# EAGLE board Harms Professional RAM-16-3 (EAGLE 6.4), part 1 of 2
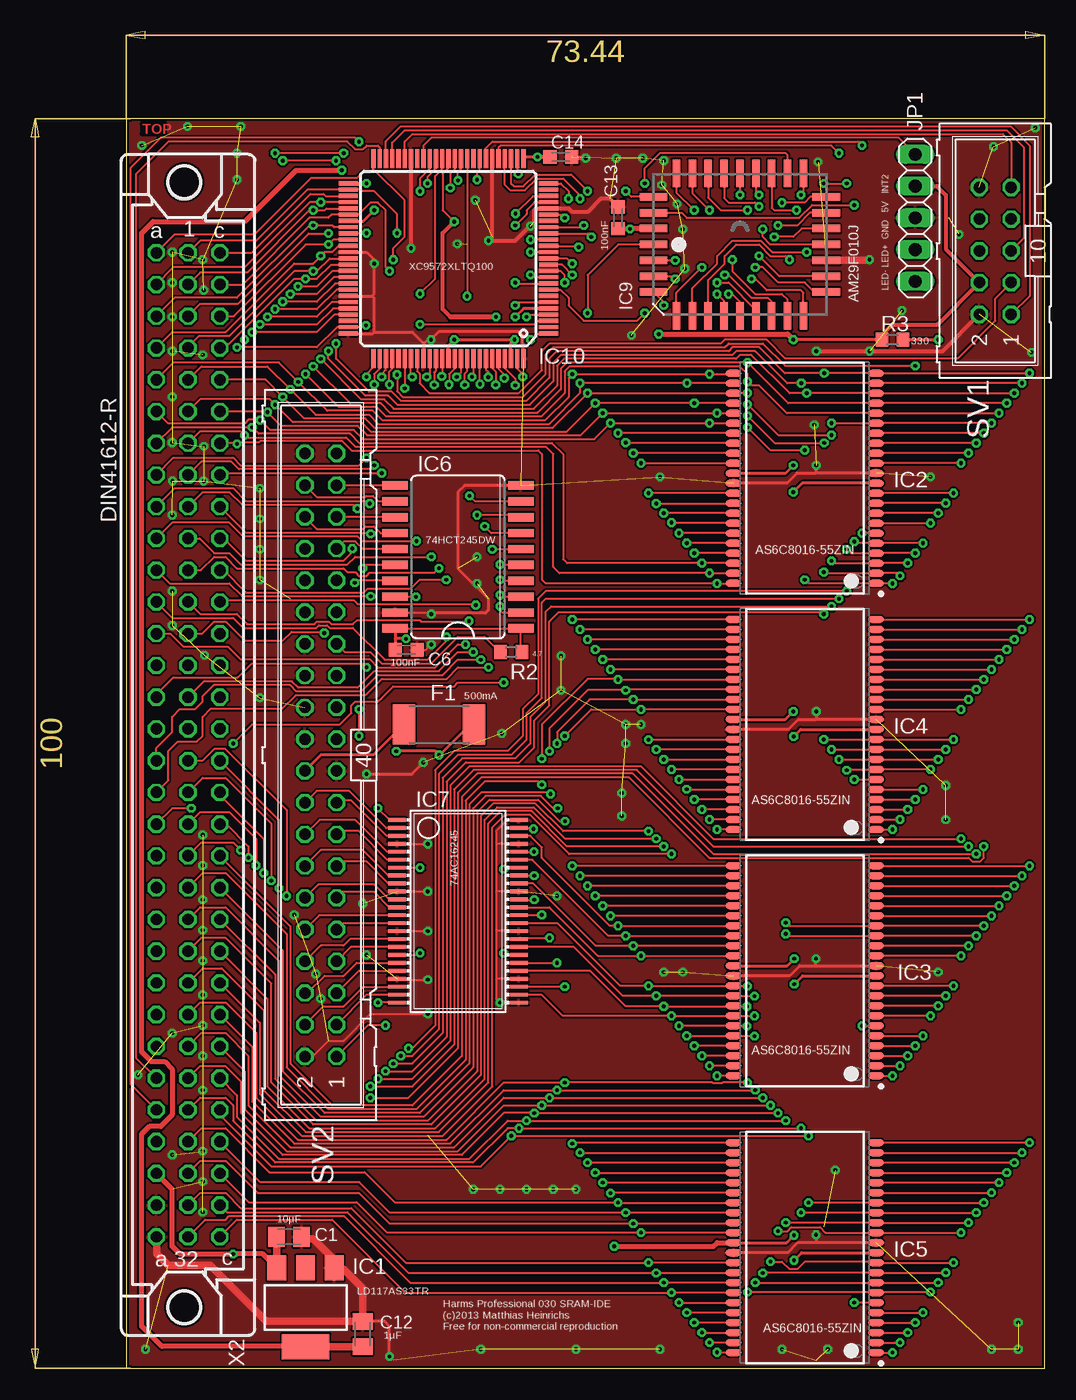
[diagram p2: board, top side]
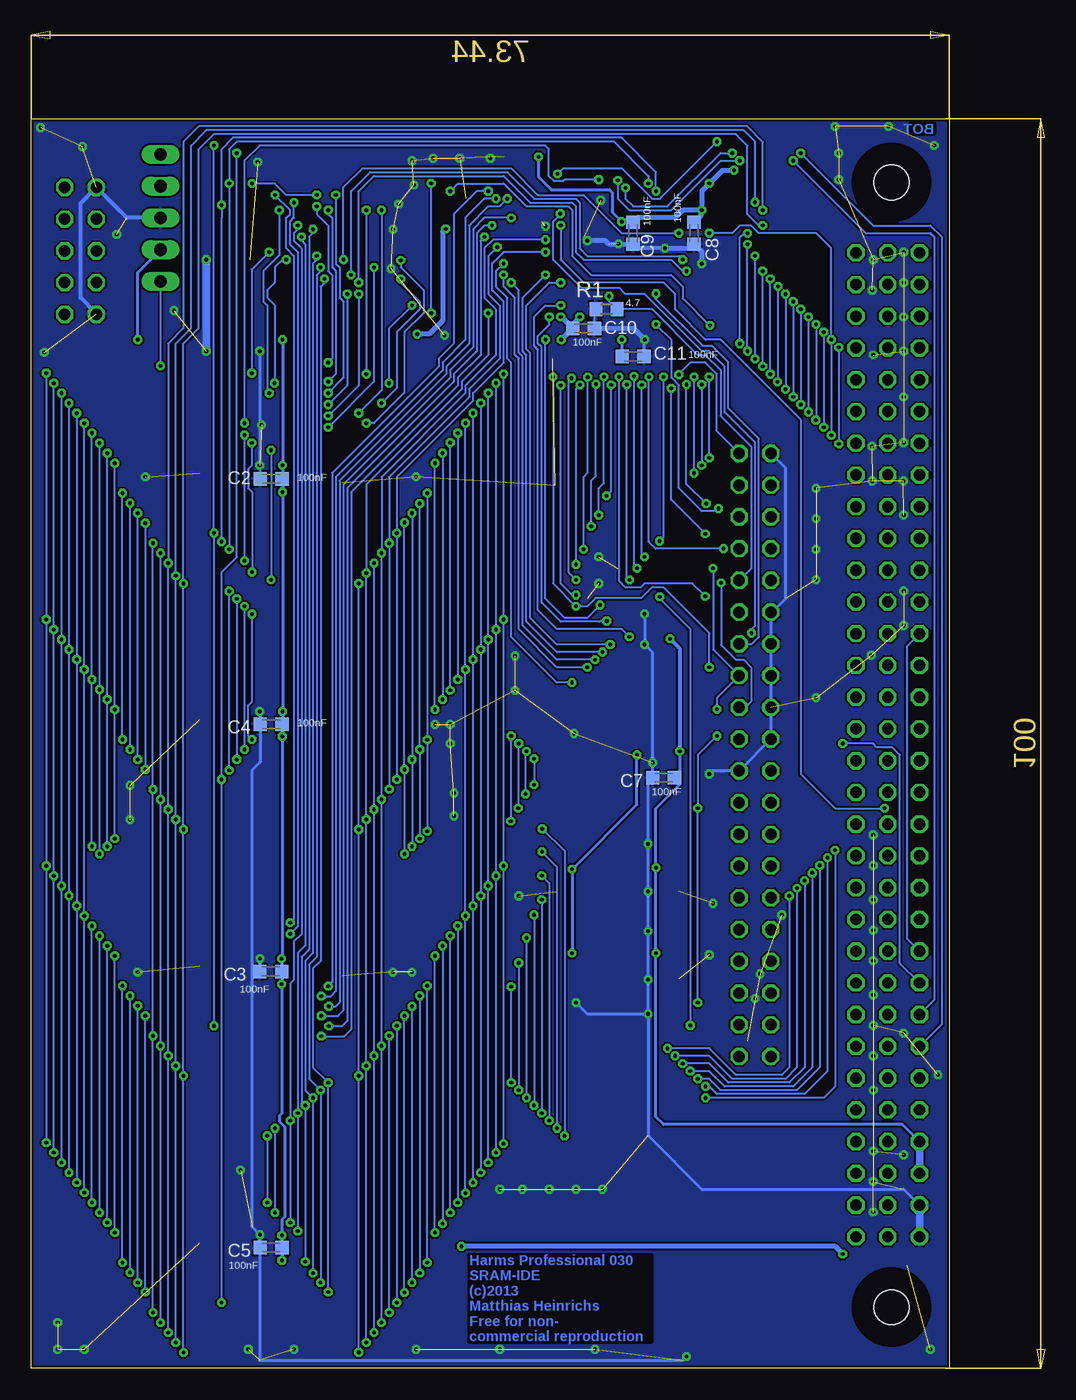
[diagram p3: board, bottom side, seen from below]

Size 73.44 x 100 mm. Coordinates in mm from the lower left corner, seen from the top.
Outline: 0,0 73.44,0 73.44,100 0,100 0,0
Copper layers (1*16): Top 0.035mm / dielectric 1.5mm / Bottom 0.035mm
Design rules "platinensammler_02 *": minimum track width 0.15mm, minimum drill 0.3mm, track to track 0.15mm, track to pad 0.15mm, pad to pad 0.15mm, via to via 0.15mm, smd to smd 0mil, copper to edge 0.2mm, drill to drill 0.2mm, minimum pad ring 0.2mm, minimum via ring 0.2mm, stop-mask expansion 4mil, vias tented up to drill 0.8mm, thermal gap 0.15mm

## Footprints (pad centres in the part's own frame; a part is rotated, then mirrored left to right if it is on the bottom)
C0805K = smd 1.3 x 1.6: 1 -1,0; 2 1,0
C0603K = smd 1.05 x 1.08: 1 -0.875,0; 2 0.875,0
R2512 = smd 1.8 x 3.2: 1 -2.8,0; 2 2.8,0
SOT223 = smd 1.5 x 2: 1 -2.3,-3.15; 2 0,-3.15; 3 2.3,-3.15 | smd 3.8 x 2: 4 0,3.15
TSOP-2_44 = smd 1.25 x 0.55: 1 -5.7,8.4; 2 -5.7,7.6; 3 -5.7,6.8; 4 -5.7,6; 5 -5.7,5.2; 6 -5.7,4.4; 7 -5.7,3.6; 8 -5.7,2.8; 9 -5.7,2; 10 -5.7,1.2; 11 -5.7,0.4; 12 -5.7,-0.4; 13 -5.7,-1.2; 14 -5.7,-2; 15 -5.7,-2.8; 16 -5.7,-3.6; 17 -5.7,-4.4; 18 -5.7,-5.2; 19 -5.7,-6; 20 -5.7,-6.8; 21 -5.7,-7.6; 22 -5.7,-8.4; 23 5.7,-8.4; 24 5.7,-7.6; 25 5.7,-6.8; 26 5.7,-6; 27 5.7,-5.2; 28 5.7,-4.4; 29 5.7,-3.6; 30 5.7,-2.8; 31 5.7,-2; 32 5.7,-1.2; 33 5.7,-0.4; 34 5.7,0.4; 35 5.7,1.2; 36 5.7,2; 37 5.7,2.8; 38 5.7,3.6; 39 5.7,4.4; 40 5.7,5.2; 41 5.7,6; 42 5.7,6.8; 43 5.7,7.6; 44 5.7,8.4
SO20W = smd 0.66 x 2.032: 1 -5.715,-5.029; 2 -4.445,-5.029; 3 -3.175,-5.029; 4 -1.905,-5.029; 5 -0.635,-5.029; 6 0.635,-5.029; 7 1.905,-5.029; 8 3.175,-5.029; 9 4.445,-5.029; 10 5.715,-5.029; 11 5.715,5.029; 12 4.445,5.029; 13 3.175,5.029; 14 1.905,5.029; 15 0.635,5.029; 16 -0.635,5.029; 17 -1.905,5.029; 18 -3.175,5.029; 19 -4.445,5.029; 20 -5.715,5.029
SSOP48DL = smd 0.305 x 1.422: 1 -6.985,-4.877; 2 -6.35,-4.877; 3 -5.715,-4.877; 4 -5.08,-4.877; 5 -4.445,-4.877; 6 -3.81,-4.877; 7 -3.175,-4.877; 8 -2.54,-4.877; 9 -1.905,-4.877; 10 -1.27,-4.877; 11 -0.635,-4.877; 12 0,-4.877; 13 0.635,-4.877; 14 1.27,-4.877; 15 1.905,-4.877; 16 2.54,-4.877; 17 3.175,-4.877; 18 3.81,-4.877; 19 4.445,-4.877; 20 5.08,-4.877; 21 5.715,-4.877; 22 6.35,-4.877; 23 6.985,-4.877; 24 7.62,-4.877; 25 7.62,4.877; 26 6.985,4.877; 27 6.35,4.877; 28 5.715,4.877; 29 5.08,4.877; 30 4.445,4.877; 31 3.81,4.877; 32 3.175,4.877; 33 2.54,4.877; 34 1.905,4.877; 35 1.27,4.877; 36 0.635,4.877; 37 0,4.877; 38 -0.635,4.877; 39 -1.27,4.877; 40 -1.905,4.877; 41 -2.54,4.877; 42 -3.175,4.877; 43 -3.81,4.877; 44 -4.445,4.877; 45 -5.08,4.877; 46 -5.715,4.877; 47 -6.35,4.877; 48 -6.985,4.877
PLCC32R = smd 0.6 x 2.2: 1 0,6.9; 2 -1.27,6.9; 3 -2.54,6.9; 4 -3.81,6.9; 14 -3.81,-6.9; 15 -2.54,-6.9; 16 -1.27,-6.9; 17 0,-6.9; 18 1.27,-6.9; 19 2.54,-6.9; 20 3.81,-6.9; 30 3.81,6.9; 31 2.54,6.9; 32 1.27,6.9 | smd 2.2 x 0.6: 5 -5.7,5.08; 6 -5.7,3.81; 7 -5.7,2.54; 8 -5.7,1.27; 9 -5.7,0; 10 -5.7,-1.27; 11 -5.7,-2.54; 12 -5.7,-3.81; 13 -5.7,-5.08; 21 5.7,-5.08; 22 5.7,-3.81; 23 5.7,-2.54; 24 5.7,-1.27; 25 5.7,0; 26 5.7,1.27; 27 5.7,2.54; 28 5.7,3.81; 29 5.7,5.08
TQ100 = smd 1.524 x 0.343: 1 -4.19,3.46; 2 -4.19,2.96; 3 -4.19,2.46; 4 -4.19,1.96; 5 -4.19,1.46; 6 -4.19,0.96; 7 -4.19,0.46; 8 -4.19,-0.04; 9 -4.19,-0.54; 10 -4.19,-1.04; 11 -4.19,-1.54; 13 -4.19,-2.54; 14 -4.19,-3.04; 15 -4.19,-3.54; 16 -4.19,-4.04; 17 -4.19,-4.54; 18 -4.19,-5.04; 19 -4.19,-5.54; 20 -4.19,-6.04; 21 -4.19,-6.54; 22 -4.19,-7.04; 23 -4.19,-7.54; 24 -4.19,-8.04; 25 -4.19,-8.54; 51 11.81,-8.54; 52 11.81,-8.04; 53 11.81,-7.54; 54 11.81,-7.04; 55 11.81,-6.54; 56 11.81,-6.04; 57 11.81,-5.54; 58 11.81,-5.04; 59 11.81,-4.54; 60 11.81,-4.04; 61 11.81,-3.54; 62 11.81,-3.04; 63 11.81,-2.54; 64 11.81,-2.04; 65 11.81,-1.54; 66 11.81,-1.04; 67 11.81,-0.54; 68 11.81,-0.04; 69 11.81,0.46; 70 11.81,0.96; 71 11.81,1.46; 72 11.81,1.96; 73 11.81,2.46; 74 11.81,2.96; 75 11.81,3.46 | smd 1.5 x 0.35: 12 -4.19,-2.04 | smd 0.343 x 1.524: 26 -2.19,-10.54; 27 -1.69,-10.54; 28 -1.19,-10.54; 29 -0.69,-10.54; 30 -0.19,-10.54; 31 0.31,-10.54; 32 0.81,-10.54; 33 1.31,-10.54; 34 1.81,-10.54; 35 2.31,-10.54; 36 2.81,-10.54; 37 3.31,-10.54; 38 3.81,-10.54; 39 4.31,-10.54; 40 4.81,-10.54; 41 5.31,-10.54; 42 5.81,-10.54; 43 6.31,-10.54; 44 6.81,-10.54; 45 7.31,-10.54; 46 7.81,-10.54; 47 8.31,-10.54; 48 8.81,-10.54; 49 9.31,-10.54; 50 9.81,-10.54; 76 9.81,5.46; 77 9.31,5.46; 78 8.81,5.46; 79 8.31,5.46; 80 7.81,5.46; 81 7.31,5.46; 82 6.81,5.46; 83 6.31,5.46; 84 5.81,5.46; 85 5.31,5.46; 86 4.81,5.46; 87 4.31,5.46; 88 3.81,5.46; 89 3.31,5.46; 90 2.81,5.46; 91 2.31,5.46; 92 1.81,5.46; 93 1.31,5.46; 94 0.81,5.46; 95 0.31,5.46; 96 -0.19,5.46; 97 -0.69,5.46; 98 -1.19,5.46; 99 -1.69,5.46; 100 -2.19,5.46
1X05 = drill 1.016 long: 1 -5.08,0; 2 -2.54,0; 3 0,0; 4 2.54,0; 5 5.08,0
R0603 = smd 1 x 1.1: 1 -0.85,0; 2 0.85,0
ML10 = drill 0.914 octagon: 1 -5.08,-1.27; 2 -5.08,1.27; 3 -2.54,-1.27; 4 -2.54,1.27; 5 0,-1.27; 6 0,1.27; 7 2.54,-1.27; 8 2.54,1.27; 9 5.08,-1.27; 10 5.08,1.27
ML40 = drill 0.914 octagon: 1 -24.13,-1.27; 2 -24.13,1.27; 3 -21.59,-1.27; 4 -21.59,1.27; 5 -19.05,-1.27; 6 -19.05,1.27; 7 -16.51,-1.27; 8 -16.51,1.27; 9 -13.97,-1.27; 10 -13.97,1.27; 11 -11.43,-1.27; 12 -11.43,1.27; 13 -8.89,-1.27; 14 -8.89,1.27; 15 -6.35,-1.27; 16 -6.35,1.27; 17 -3.81,-1.27; 18 -3.81,1.27; 19 -1.27,-1.27; 20 -1.27,1.27; 21 1.27,-1.27; 22 1.27,1.27; 23 3.81,-1.27; 24 3.81,1.27; 25 6.35,-1.27; 26 6.35,1.27; 27 8.89,-1.27; 28 8.89,1.27; 29 11.43,-1.27; 30 11.43,1.27; 31 13.97,-1.27; 32 13.97,1.27; 33 16.51,-1.27; 34 16.51,1.27; 35 19.05,-1.27; 36 19.05,1.27; 37 21.59,-1.27; 38 21.59,1.27; 39 24.13,-1.27; 40 24.13,1.27
MABC96R = drill 0.914 octagon: A1 -2.54,39.37; A2 -2.54,36.83; A3 -2.54,34.29; A4 -2.54,31.75; A5 -2.54,29.21; A6 -2.54,26.67; A7 -2.54,24.13; A8 -2.54,21.59; A9 -2.54,19.05; A10 -2.54,16.51; A11 -2.54,13.97; A12 -2.54,11.43; A13 -2.54,8.89; A14 -2.54,6.35; A15 -2.54,3.81; A16 -2.54,1.27; A17 -2.54,-1.27; A18 -2.54,-3.81; A19 -2.54,-6.35; A20 -2.54,-8.89; A21 -2.54,-11.43; A22 -2.54,-13.97; A23 -2.54,-16.51; A24 -2.54,-19.05; A25 -2.54,-21.59; A26 -2.54,-24.13; A27 -2.54,-26.67; A28 -2.54,-29.21; A29 -2.54,-31.75; A30 -2.54,-34.29; A31 -2.54,-36.83; A32 -2.54,-39.37; B1 0,39.37; B2 0,36.83; B3 0,34.29; B4 0,31.75; B5 0,29.21; B6 0,26.67; B7 0,24.13; B8 0,21.59; B9 0,19.05; B10 0,16.51; B11 0,13.97; B12 0,11.43; B13 0,8.89; B14 0,6.35; B15 0,3.81; B16 0,1.27; B17 0,-1.27; B18 0,-3.81; B19 0,-6.35; B20 0,-8.89; B21 0,-11.43; B22 0,-13.97; B23 0,-16.51; B24 0,-19.05; B25 0,-21.59; B26 0,-24.13; B27 0,-26.67; B28 0,-29.21; B29 0,-31.75; B30 0,-34.29; B31 0,-36.83; B32 0,-39.37; C1 2.54,39.37; C2 2.54,36.83; C3 2.54,34.29; C4 2.54,31.75; C5 2.54,29.21; C6 2.54,26.67; C7 2.54,24.13; C8 2.54,21.59; C9 2.54,19.05; C10 2.54,16.51; C11 2.54,13.97; C12 2.54,11.43; C13 2.54,8.89; C14 2.54,6.35; C15 2.54,3.81; C16 2.54,1.27; C17 2.54,-1.27; C18 2.54,-3.81; C19 2.54,-6.35; C20 2.54,-8.89; C21 2.54,-11.43; C22 2.54,-13.97; C23 2.54,-16.51; C24 2.54,-19.05; C25 2.54,-21.59; C26 2.54,-24.13; C27 2.54,-26.67; C28 2.54,-29.21; C29 2.54,-31.75; C30 2.54,-34.29; C31 2.54,-36.83; C32 2.54,-39.37 | hole 2.794: -0.305,45; -0.305,-45

## Placement (x,y rotation side)
C1  10µF  [C0805K]  13,10.52 0 top
C2  100nF  [C0603K]  54.25,71.17 180 bottom
C3  100nF  [C0603K]  54.28,31.75 180 bottom
C4  100nF  [C0603K]  54.25,51.54 180 bottom
C5  100nF  [C0603K]  54.25,9.65 180 bottom
C6  100nF  [C0603K]  22.38,57.48 0 top
C7  100nF  [C0603K]  22.86,47.24 180 bottom
C8  100nF  [C0603K]  20.42,90.83 270 bottom
C9  100nF  [C0603K]  25.3,90.83 270 bottom
C10  100nF  [C0603K]  29.26,83.21 0 bottom
C11  100nF  [C0603K]  25.3,80.95 0 bottom
C12  1µF  [C0805K]  18.9,2.74 90 top
C13  100nF  [C0603K]  39.32,92.05 90 top
C14  100nF  [C0603K]  34.75,96.93 0 top
F1  500mA  [R2512]  24.99,51.51 0 top
IC1  LD117AS33TR  [SOT223]  14.33,4.88 180 top
IC2  AS6C8016-55ZIN  [TSOP-2_44]  54.25,71.22 180 top
IC3  AS6C8016-55ZIN  [TSOP-2_44]  54.25,31.8 180 top
IC4  AS6C8016-55ZIN  [TSOP-2_44]  54.25,51.51 180 top
IC5  AS6C8016-55ZIN  [TSOP-2_44]  54.25,9.65 180 top
IC6  74HCT245DW  [SO20W]  26.52,64.92 90 top
IC7  74AC16245  [SSOP48DL]  26.52,36.88 270 top
IC9  AM29F010J  [PLCC32R]  49.07,89.92 90 top
IC10  XC9572XLTQ100  [TQ100]  29.57,86.26 180 top
JP1  [1X05]  63.09,92.05 90 top
R1  4.7  [R0603]  27.43,84.73 0 bottom
R2  4.7  [R0603]  30.79,57.3 180 top
R3  330  [R0603]  61.27,82.3 0 top
SV1  [ML10]  69.49,89.41 90 top
SV2  [ML40]  15.54,49.07 90 top
X2  MABC96R  [MABC96R]  4.93,49.89 0 top